# EAGLE design Board2 (EAGLE 7.4.0)
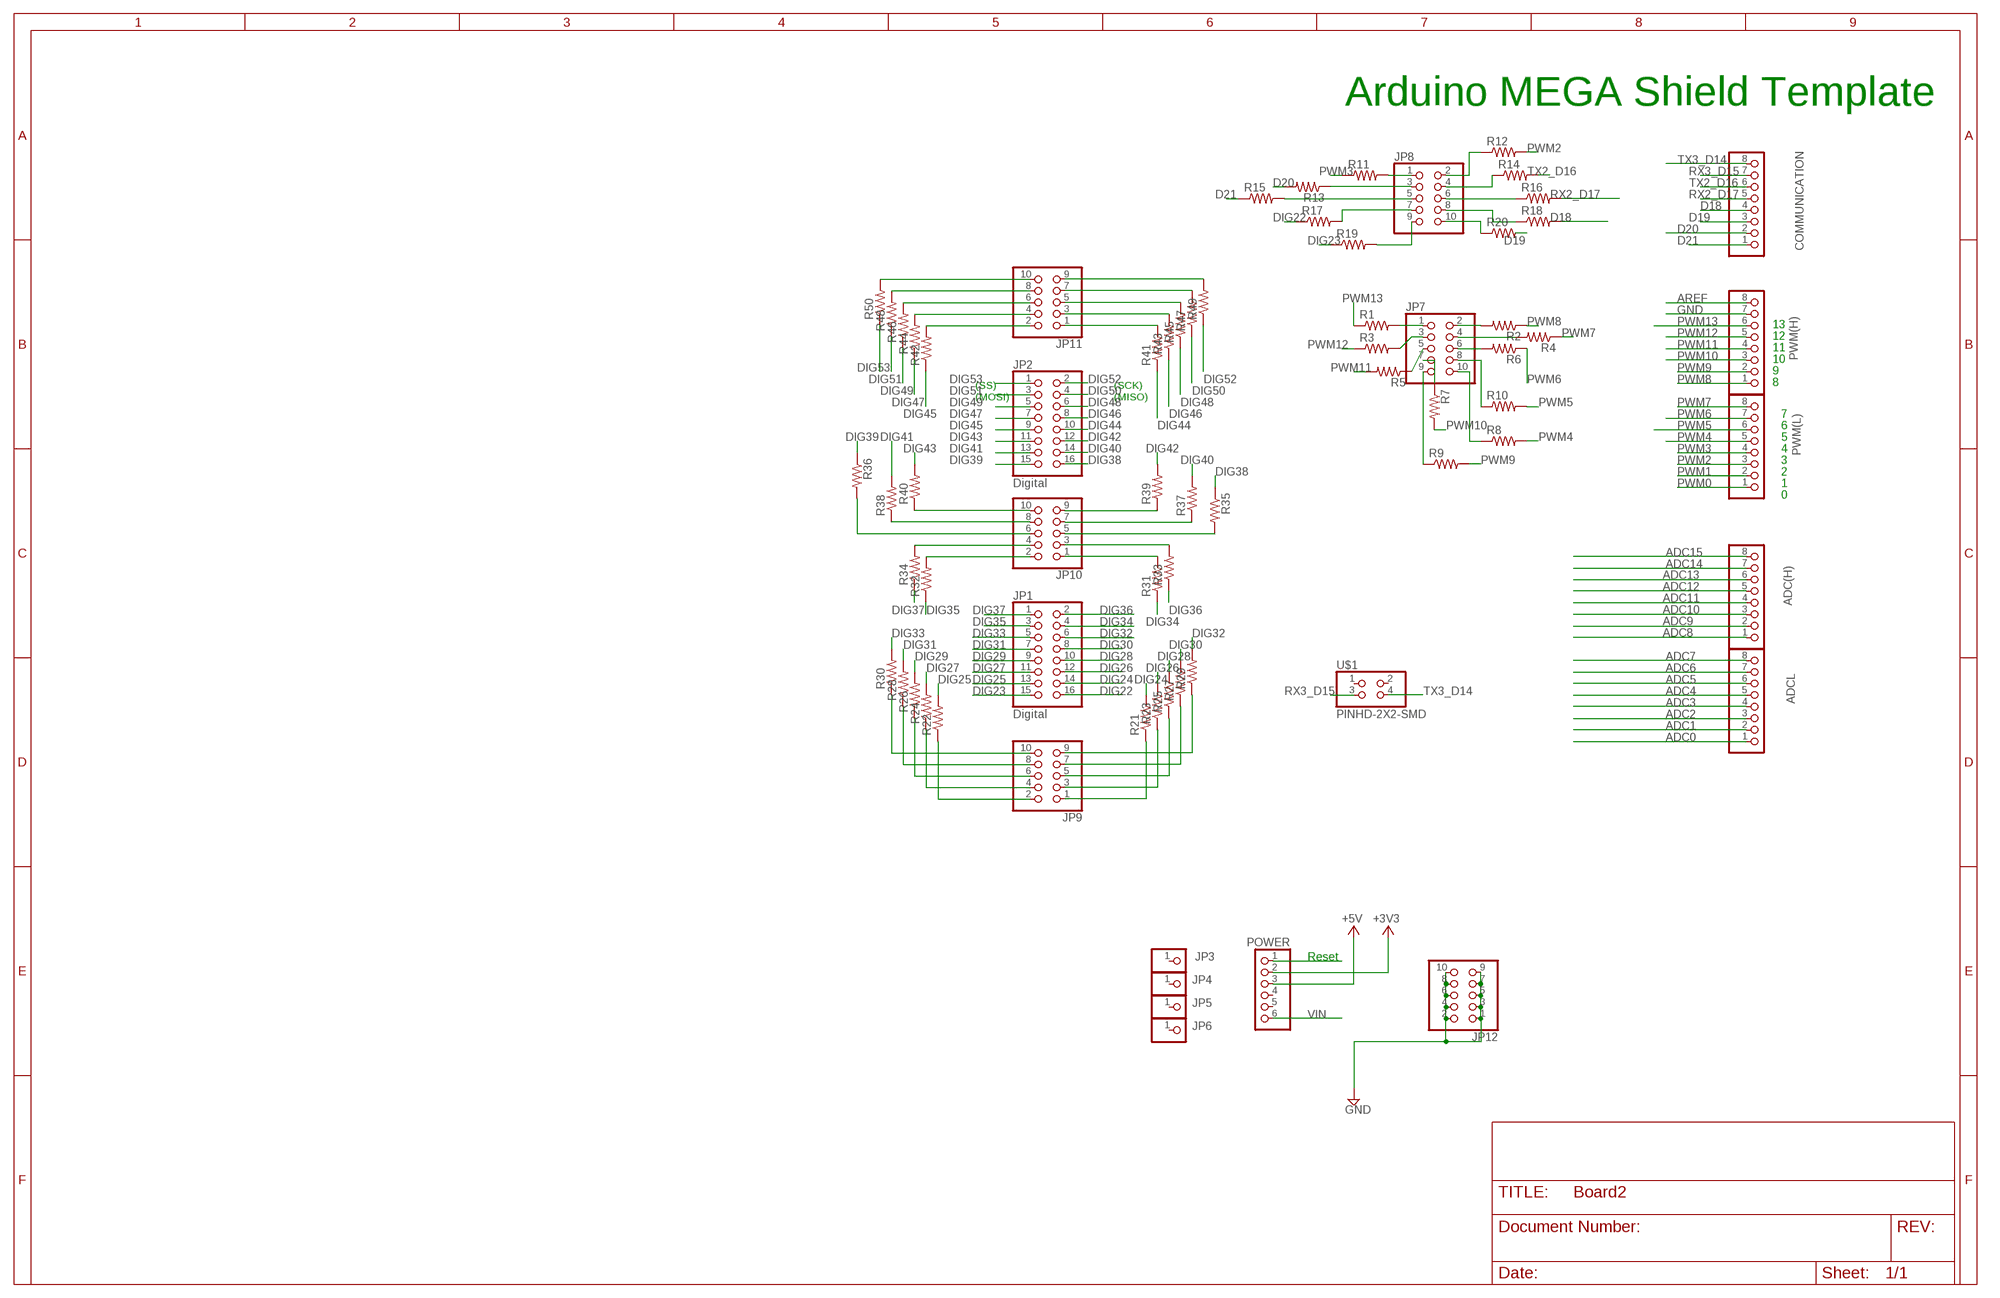
[diagram p0: schematic, sheet 1]

## Parts
ADC(H)  PINHD-1X8  [1X08]
ADCL  PINHD-1X8  [1X08]
COMMUNICATION  PINHD-1X8  [1X08]
JP1  Digital  PINHD-2X8  [2X08]
JP2  Digital  PINHD-2X8  [2X08]
JP3  PINHD-1X1  [1X01]
JP4  PINHD-1X1  [1X01]
JP5  PINHD-1X1  [1X01]
JP6  PINHD-1X1  [1X01]
JP7  PINHD-2X5SMT  [2X05_SMT]
JP8  PINHD-2X5SMT  [2X05_SMT]
JP9  PINHD-2X5SMT  [2X05_SMT]
JP10  PINHD-2X5SMT  [2X05_SMT]
JP11  PINHD-2X5SMT  [2X05_SMT]
JP12  PINHD-2X5SMT  [2X05_SMT]
POWER  PINHD-1X6  [1X06]
PWM(H)  PINHD-1X8  [1X08]
PWM(L)  PINHD-1X8  [1X08]
R1  R-US_M1206  [M1206]
R2  R-US_M1206  [M1206]
R3  R-US_M1206  [M1206]
R4  R-US_M1206  [M1206]
R5  R-US_M1206  [M1206]
R6  R-US_M1206  [M1206]
R7  R-US_M1206  [M1206]
R8  R-US_M1206  [M1206]
R9  R-US_M1206  [M1206]
R10  R-US_M1206  [M1206]
R11  R-US_M1206  [M1206]
R12  R-US_M1206  [M1206]
R13  R-US_M1206  [M1206]
R14  R-US_M1206  [M1206]
R15  R-US_M1206  [M1206]
R16  R-US_M1206  [M1206]
R17  R-US_M1206  [M1206]
R18  R-US_M1206  [M1206]
R19  R-US_M1206  [M1206]
R20  R-US_M1206  [M1206]
R21  R-US_M1206  [M1206]
R22  R-US_M1206  [M1206]
R23  R-US_M1206  [M1206]
R24  R-US_M1206  [M1206]
R25  R-US_M1206  [M1206]
R26  R-US_M1206  [M1206]
R27  R-US_M1206  [M1206]
R28  R-US_M1206  [M1206]
R29  R-US_M1206  [M1206]
R30  R-US_M1206  [M1206]
R31  R-US_M1206  [M1206]
R32  R-US_M1206  [M1206]
R33  R-US_M1206  [M1206]
R34  R-US_M1206  [M1206]
R35  R-US_M1206  [M1206]
R36  R-US_M1206  [M1206]
R37  R-US_M1206  [M1206]
R38  R-US_M1206  [M1206]
R39  R-US_M1206  [M1206]
R40  R-US_M1206  [M1206]
R41  R-US_M1206  [M1206]
R42  R-US_M1206  [M1206]
R43  R-US_M1206  [M1206]
R44  R-US_M1206  [M1206]
R45  R-US_M1206  [M1206]
R46  R-US_M1206  [M1206]
R47  R-US_M1206  [M1206]
R48  R-US_M1206  [M1206]
R49  R-US_M1206  [M1206]
R50  R-US_M1206  [M1206]
U$1  PINHD-2X2-SMD  [2X02SMD]

## Nets
+3V3 [power]: POWER.2
+5V [usbvcc]: POWER.3
ADC0: ADCL.1
ADC1: ADCL.2
ADC2: ADCL.3
ADC3: ADCL.4
ADC4: ADCL.5
ADC5: ADCL.6
ADC6: ADCL.7
ADC7: ADCL.8
ADC8: ADC(H).1
ADC9: ADC(H).2
ADC10: ADC(H).3
ADC11: ADC(H).4
ADC12: ADC(H).5
ADC13: ADC(H).6
ADC14: ADC(H).7
ADC15: ADC(H).8
AREF: PWM(H).8
D18: COMMUNICATION.4 R18.2
D19: COMMUNICATION.3 R20.2
D20: COMMUNICATION.2 R13.2
D21: COMMUNICATION.1 R15.1
DIG22: JP1.16 R17.1
DIG23: JP1.15 R19.1
DIG24: JP1.14 R21.2
DIG25: JP1.13 R22.2
DIG26 [gnd]: JP1.12 R23.2
DIG27: JP1.11 R24.2
DIG28: JP1.10 R25.2
DIG29: JP1.9 R26.2
DIG30: JP1.8 R27.2
DIG31: JP1.7 R28.2
DIG32: JP1.6 R29.2
DIG33: JP1.5 R30.2
DIG34: JP1.4 R31.1
DIG35: JP1.3 R32.1
DIG36: JP1.2 R33.1
DIG37: JP1.1 R34.1
DIG38: JP2.16 R35.1
DIG39: JP2.15 R36.1
DIG40: JP2.14 R37.2
DIG41: JP2.13 R38.2
DIG42: JP2.12 R39.2
DIG43: JP2.11 R40.2
DIG44: JP2.10 R41.1
DIG45: JP2.9 R42.1
DIG46: JP2.8 R43.1
DIG47: JP2.7 R44.1
DIG48: JP2.6 R45.1
DIG49: JP2.5 R46.1
DIG50: JP2.4 R47.1
DIG51: JP2.3 R48.1
DIG52: JP2.2 R49.1
DIG53: JP2.1 R50.1
GND [gnd]: JP12.1 JP12.2 JP12.3 JP12.4 JP12.5 JP12.6 JP12.7 JP12.8 JP12.9 JP12.10 PWM(H).7
N$1: JP7.3 R3.2
N$2: JP7.5 R5.1
N$3: JP7.7 R7.1
N$4: JP7.9 R9.1
N$5: JP7.4 R4.2
N$6: JP8.5 R15.2
N$7: JP7.6 R6.2
N$8: JP7.2 R2.2
N$9: JP7.8 R10.1
N$10: JP8.1 R11.2
N$11: JP8.2 R12.1
N$12: JP7.10 R8.1
N$13: JP8.7 R17.2
N$14: JP10.6 R36.2
N$15: JP8.6 R16.1
N$16: JP10.5 R35.2
N$17: JP8.4 R14.1
N$18: JP9.2 R22.1
N$19: JP7.1 R1.2
N$20: JP8.10 R20.1
N$21: JP9.4 R24.1
N$22: JP9.6 R26.1
N$23: JP9.8 R28.1
N$24: JP9.10 R30.1
N$25: JP9.1 R21.1
N$26: JP9.3 R23.1
N$27: JP9.5 R25.1
N$28: JP9.7 R27.1
N$29: JP9.9 R29.1
N$32: JP10.3 R33.2
N$33: JP10.1 R31.2
N$34: JP10.2 R32.2
N$35: JP10.4 R34.2
N$37: JP10.7 R37.1
N$38: JP10.9 R39.1
N$39: JP10.8 R38.1
N$40: JP10.10 R40.1
N$41: JP11.9 R49.2
N$42: JP11.7 R47.2
N$43: JP11.5 R45.2
N$44: JP11.3 R43.2
N$45: JP11.1 R41.2
N$46: JP11.2 R42.2
N$47: JP11.4 R44.2
N$48: JP11.6 R46.2
N$49: JP11.8 R48.2
N$50: JP11.10 R50.2
N$52: JP8.9 R19.2
PWM0: PWM(L).1
PWM1: PWM(L).2
PWM2: PWM(L).3 R12.2
PWM3: PWM(L).4 R11.1
PWM4: PWM(L).5 R8.2
PWM5: PWM(L).6 R10.2
PWM6: PWM(L).7 R6.1
PWM7: PWM(L).8 R4.1
PWM8: PWM(H).1 R2.1
PWM9: PWM(H).2 R9.2
PWM10: PWM(H).3 R7.2
PWM11: PWM(H).4 R5.2
PWM12: PWM(H).5 R3.1
PWM13: PWM(H).6 R1.1
RESET: POWER.1
RX1_D19: JP8.8 R18.1
RX2_D17: COMMUNICATION.5 R16.2
RX3_D15: COMMUNICATION.7 U$1.3
RX4_D14: JP8.3 R13.1
TX2_D16: COMMUNICATION.6 R14.2
TX3_D14: COMMUNICATION.8 U$1.4
VIN [power]: POWER.6
Unconnected: JP3.1 JP4.1 JP5.1 JP6.1 POWER.4 POWER.5 U$1.1 U$1.2

## Notes on the sheet
- Arduino MEGA Shield Template
- 13
- 12
- 11
- 10
- 9
- (SS) | (SCK) | 8
- (MOSI) | (MISO)
- 7
- 6
- 5
- 4
- 3
- 2
- 1
- 0
- Reset

## Library data of the parts
ADC(H) ADCL COMMUNICATION PWM(H) PWM(L) = pinhead:PINHD-1X8: PIN HEADER
JP1 JP2 = pinhead:PINHD-2X8: PIN HEADER
JP3-JP6 = pinhead:PINHD-1X1: PIN HEADER
JP7-JP12 = pinhead+:PINHD-2X5: PIN HEADER
POWER = pinhead:PINHD-1X6: PIN HEADER
R1-R50 = resistor:R-US_: RESISTOR, American symbol
U$1 = fab:PINHD-2X2-SMD

## Net classes
0 default: width 0.203 mm, drill 0.406 mm, clearance 0.203 mm
1 power: width 0.203 mm, drill 0.711 mm, clearance 0.203 mm
2 gnd: width 0.203 mm, drill 0.711 mm, clearance 0.203 mm
3 usbvcc: width 0.203 mm, drill 0.711 mm, clearance 0.203 mm

## Board
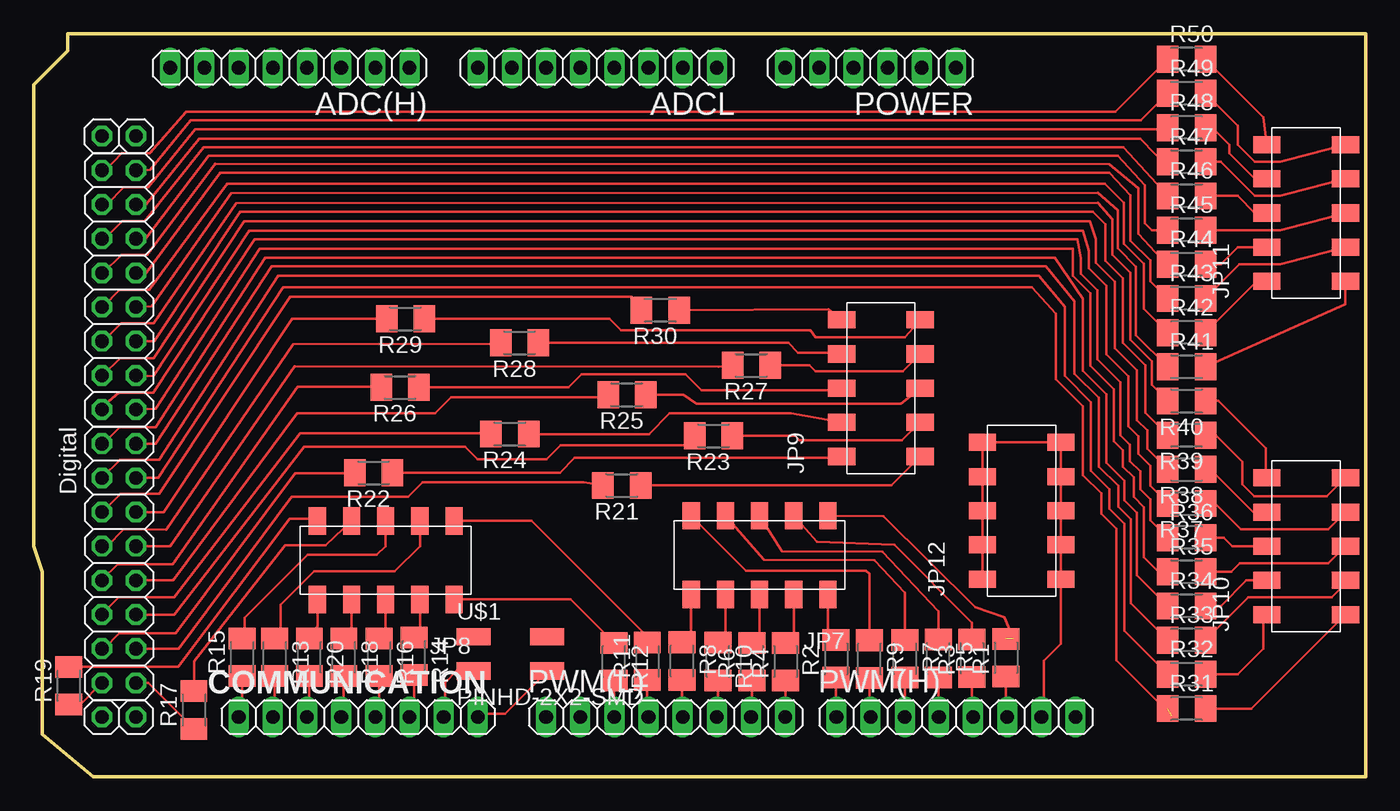
[diagram p1: board, top side]

Size 99.06 x 55.25 mm. Coordinates in mm from the lower left corner, seen from the top.
Outline: 99.06,0 4.45,0 0.64,3.17 0.64,15.24 0,17.14 0,51.44 2.54,53.98 2.54,55.25 99.06,55.25 99.06,0
Copper layers (1*16): Top 0.035mm / dielectric 1.5mm / Bottom 0.035mm
Design rules "fab": minimum track width 0.3mm, minimum drill 32mil, track to track 0.397mm, track to pad 0.397mm, pad to pad 0.397mm, via to via 0.397mm, smd to smd 0.315mm, copper to edge 40mil, drill to drill 16mil, minimum pad ring 10mil, minimum via ring 8mil, stop-mask expansion 4mil, vias tented up to drill 0mil, thermal gap 10mil

### Footprints (pad centres in the part's own frame; a part is rotated, then mirrored left to right if it is on the bottom)
1X08 = drill 1.016 long: 1 -8.89,0; 2 -6.35,0; 3 -3.81,0; 4 -1.27,0; 5 1.27,0; 6 3.81,0; 7 6.35,0; 8 8.89,0
2X08 = drill 1.016 octagon: 1 -8.89,-1.27; 2 -8.89,1.27; 3 -6.35,-1.27; 4 -6.35,1.27; 5 -3.81,-1.27; 6 -3.81,1.27; 7 -1.27,-1.27; 8 -1.27,1.27; 9 1.27,-1.27; 10 1.27,1.27; 11 3.81,-1.27; 12 3.81,1.27; 13 6.35,-1.27; 14 6.35,1.27; 15 8.89,-1.27; 16 8.89,1.27
1X01 = drill 1.016 octagon: 1 0,0
2X05_SMT = smd 1.27 x 2.032: 1 -5.08,-2.921; 2 -5.08,2.921; 3 -2.54,-2.921; 4 -2.54,2.921; 5 0,-2.921; 6 0,2.921; 7 2.54,-2.921; 8 2.54,2.921; 9 5.08,-2.921; 10 5.08,2.921
1X06 = drill 1.016 long: 1 -6.35,0; 2 -3.81,0; 3 -1.27,0; 4 1.27,0; 5 3.81,0; 6 6.35,0
M1206 = smd 1.6 x 2: 1 -1.4,0; 2 1.4,0
2X02SMD = smd 2.54 x 1.27: 1 -2.54,1.27; 2 2.92,1.27; 3 -2.54,-1.27; 4 2.92,-1.27

### Placement (x,y rotation side)
ADC(H)  19.05,52.7 180 top
ADCL  41.91,52.7 180 top
COMMUNICATION  24.13,4.45 0 top
JP1  6.35,15.88 270 top
JP2  6.35,36.2 270 top
JP3  7.62,4.45 180 top
JP4  5.08,4.45 180 top
JP5  7.62,47.62 180 top
JP6  5.08,47.62 180 top
JP7  53.98,16.48 180 top
JP8  26.18,16.11 180 top
JP9  63,28.89 90 top
JP10  94.61,17.14 90 top
JP11  94.61,41.91 90 top
JP12  73.46,19.78 90 top
POWER  62.23,52.7 180 top
PWM(H)  68.58,4.45 0 top
PWM(L)  46.99,4.45 0 top
R1  72.31,8.86 90 top
R2  59.66,8.77 90 top
R3  69.77,8.82 90 top
R4  55.92,8.57 90 top
R5  67.27,8.8 270 top
R6  53.4,8.57 90 top
R7  64.79,8.78 270 top
R8  48.21,8.61 270 top
R9  62.14,8.76 270 top
R10  50.88,8.57 270 top
R11  45.63,8.59 90 top
R12  43.15,8.57 270 top
R13  17.92,8.89 270 top
R14  28.28,8.97 270 top
R15  15.5,8.9 90 top
R16  25.7,8.89 270 top
R17  11.92,4.98 90 top
R18  23.07,8.89 270 top
R19  2.61,6.77 90 top
R20  20.5,8.89 270 top
R21  43.74,21.66 180 top
R22  25.27,22.6 180 top
R23  50.55,25.35 180 top
R24  35.41,25.49 180 top
R25  44.11,28.41 180 top
R26  27.24,28.95 180 top
R27  53.37,30.59 180 top
R28  36.14,32.26 180 top
R29  27.65,34.05 180 top
R30  46.59,34.7 180 top
R31  85.72,5.08 0 top
R32  85.72,7.62 0 top
R33  85.72,10.16 0 top
R34  85.72,12.7 0 top
R35  85.72,15.24 0 top
R36  85.72,17.78 0 top
R37  85.72,20.32 180 top
R38  85.72,22.86 180 top
R39  85.72,25.4 180 top
R40  85.72,27.94 180 top
R41  85.72,30.48 0 top
R42  85.72,33.02 0 top
R43  85.72,35.56 0 top
R44  85.72,38.1 0 top
R45  85.72,40.64 0 top
R46  85.72,43.18 0 top
R47  85.72,45.72 0 top
R48  85.72,48.26 0 top
R49  85.72,50.8 0 top
R50  85.72,53.34 0 top
U$1  35.26,9.14 0 top

### Tracks (layer width: path | path; a pad name or v marks a point on that pad's centre or on a via)
D18
  Top 0.203: R18.2 23.07,4.65 COMMUNICATION.4
D19
  Top 0.203: R20.2 20.5,4.63 COMMUNICATION.3
D20
  Top 0.203: R13.2 17.92,4.59 COMMUNICATION.2
D21
  Top 0.203: R15.1 15.5,4.7 COMMUNICATION.1
DIG22
  Top 0.203: JP1.16 8.51,6.99 R17.1
DIG23
  Top 0.203: R19.1 3.47,5.38 JP1.15
DIG24
  Top 0.203: JP1.14 10.77,9.53 19.2,20.81 27.83,20.81 28.92,21.91 40.88,21.91 R21.2
DIG25
  Top 0.203: JP1.13 5.25,9.53 6.38,10.66 10.56,10.66 19.44,22.58 23.85,22.58 R22.2
DIG26
  Top 0.203: JP1.12 10.45,12.06 20.11,24.52 32.08,24.52 32.99,23.61 38.16,23.61 39.19,24.64 48.97,24.64 49.7,25.37 49.17,25.37 R23.2
DIG27
  Top 0.203: JP1.11 5.08,12.1 6.32,13.33 10.44,13.33 19.81,25.56 33.94,25.56 R24.2
DIG28
  Top 0.203: JP1.10 10.36,14.6 19.6,27.01 29.85,27.01 31.04,28.2 42.51,28.2 R25.2
DIG29
  Top 0.203: JP1.9 5.08,14.66 6.24,15.82 10.33,15.8 19.62,29.01 25.09,29.01 25.28,29.2 25.59,29.2 R26.2
DIG30
  Top 0.203: JP1.8 10.14,17.13 19.43,30.54 50.91,30.49 R27.2
DIG31
  Top 0.203: JP1.7 5.47,17.14 6.71,18.39 9.87,18.38 19.28,32.16 34.4,32.21 R28.2
DIG32
  Top 0.203: R29.2 19.21,34.05 9.66,19.67 7.64,19.67 JP1.6
DIG33
  Top 0.203: JP1.5 5.11,19.69 6.47,21.05 9.35,21.05 19.06,35.69 44.47,35.69 R30.2
DIG34  (1 unrouted)
  Top 0.203: JP1.4 9.26,22.23 18.54,36.38 74.22,36.38 76,34.42 76,29.56 78.02,27.54 78.02,22.43 79.39,21.07 79.39,19.56 80.5,18.44 80.5,8.69 84.63,4.56
DIG35
  Top 0.203: JP1.3 6.43,23.58 9.32,23.58 18.18,37.25 74.73,37.25 76.66,34.95 76.66,29.81 78.62,27.85 78.62,22.74 79.98,21.38 79.98,19.95 81.1,18.83 81.1,10.85 R32.1
DIG36
  Top 0.203: JP1.2 9.1,24.77 17.68,37.96 75.28,37.96 77.39,35.37 77.39,29.98 79.21,28.16 79.21,23.06 80.64,21.63 80.64,20.09 81.59,19.14 81.59,12.9 R33.1
DIG37
  Top 0.203: JP1.1 5.16,24.77 6.39,26 9.08,26 17.23,38.57 75.94,38.57 78.02,35.54 78.02,30.19 79.77,28.44 79.77,23.34 81.1,22.01 81.1,20.58 82.04,19.63 82.04,14.98 R34.1
DIG38
  Top 0.203: JP2.16 9.07,27.36 16.81,39.24 77.27,39.24 77.29,37.75 77.29,37.26 78.58,35.96 78.58,30.58 80.33,28.83 80.33,24.95 80.99,24.28 80.99,23.06 81.8,22.26 81.8,20.82 82.57,20.05 82.57,16.31 83.64,15.24 R35.1
DIG39
  Top 0.203: JP2.15 5.08,27.49 6.34,28.57 8.9,28.56 16.44,39.97 77.3,39.94 77.61,39.94 77.88,38.55 77.88,37.39 79.11,36.17 79.11,31.03 80.82,29.32 80.82,25.4 81.52,24.7 81.52,23.48 82.29,22.71 82.29,21.38 83.02,20.65 83.02,19.08 R36.1 84.46,17.64 84.46,17.21
DIG40
  Top 0.203: JP2.14 8.88,29.79 16.02,40.59 78,40.59 78.48,39.11 78.48,37.81 79.77,36.52 79.77,31.42 81.41,29.77 81.41,26.07 82.15,25.33 82.15,24 83.02,23.13 83.02,21.62 R37.2
DIG41
  Top 0.203: JP2.13 5.16,29.85 6.42,31.11 8.92,31.11 15.64,41.32 78.54,41.32 78.97,39.95 78.97,38.23 80.4,36.8 80.4,31.87 82.04,30.23 82.04,26.52 82.81,25.75 82.81,24.37 R38.2
DIG42
  Top 0.203: JP2.12 8.98,32.38 15.35,42.02 78.76,41.99 79.68,41.08 79.68,38.36 80.98,37.06 80.98,32.27 82.66,30.59 82.66,27.06 R39.2
DIG43
  Top 0.203: JP2.11 5.17,32.38 6.5,33.72 8.92,33.72 15.06,42.65 79.14,42.68 80.22,41.43 80.22,38.8 81.55,37.48 81.55,32.48 83.14,30.89 83.14,29.13 R40.2
DIG44
  Top 0.203: JP2.10 8.77,34.99 14.7,43.39 79.15,43.41 80.61,42.11 80.61,39.29 81.97,37.93 81.97,32.84 R41.1
DIG45
  Top 0.203: JP2.9 5.12,34.93 6.41,36.21 8.61,36.21 14.38,44.09 79.64,44.09 81.06,42.66 81.06,39.61 82.55,38.12 82.55,34.79 R42.1
DIG46
  Top 0.203: JP2.8 8.3,37.36 13.85,44.91 79.97,44.91 81.55,43.25 81.55,39.87 83.04,38.38 83.04,36.85 R43.1
DIG47
  Top 0.203: JP2.7 5.18,37.47 6.54,38.83 8.45,38.83 13.5,45.58 79.99,45.54 82.14,43.74 82.16,40.37 84.22,38.1 R44.1
DIG48
  Top 0.203: JP2.6 8.29,39.95 13.01,46.16 80.62,46.18 82.64,43.97 82.64,41.15 83.15,40.64 R45.1
DIG49
  Top 0.203: JP2.5 5.29,40.01 6.6,41.31 8.28,41.31 12.63,46.81 81.04,46.81 R46.1
DIG50
  Top 0.203: JP2.4 8.35,42.55 12.32,47.42 82.28,47.42 84.5,45.16 84.5,45.55 R47.1
DIG51
  Top 0.203: JP2.3 5.46,42.55 6.71,43.83 8.53,43.83 12,48.12 84.19,48.12 R48.1
DIG52
  Top 0.203: JP2.2 8.67,45.12 11.68,48.81 82.33,48.81 R49.1
DIG53
  Top 0.203: JP2.1 5.36,45.09 6.57,46.34 8.63,46.34 11.33,49.45 25.83,49.45 80.44,49.45 R50.1
GND
  Top 0.203: JP12.2 JP12.4 JP12.6 JP12.8 JP12.10 JP12.9 JP12.7 JP12.5 JP12.3 JP12.1 76.38,9.88 75.12,8.62 75.12,4.64 PWM(H).7
N$1
  Top 0.203: R3.2 69.77,11.44 64.02,17.26 58.24,17.46 JP7.3
N$2
  Top 0.203: R5.1 67.27,12.3 63.13,16.74 55.65,16.78 JP7.5
N$3
  Top 0.203: R7.1 64.78,13.69 62.53,16.12 54.29,16.14 JP7.7
N$4
  Top 0.203: R9.1 62.14,15.11 61.91,15.34 52.96,15.34 JP7.9
N$5
  Top 0.203: JP7.4 56.52,10.62 R4.2
N$6
  Top 0.203: JP8.5 26.18,17.16 25.52,16.5 20.36,16.5 15.68,11.81 15.68,9.99 15.49,9.81 15.49,10.06 R15.2
N$7
  Top 0.203: JP7.6 53.98,10.57 R6.2
N$8
  Top 0.203: JP7.2 59.06,10.91 R2.2
N$9
  Top 0.203: JP7.8 51.44,10.37 R10.1
N$10
  Top 0.203: JP8.1 37.02,19.03 46.3,9.75 46.12,9.75 45.94,9.57 45.94,9.68 R11.2
N$11
  Top 0.203: JP8.2 39.93,13.19 R12.1
N$12
  Top 0.203: JP7.10 48.9,10.69 R8.1
N$13
  Top 0.203: R17.2 11.92,8.61 18.71,17.23 21.72,17.23 JP8.7
N$14
  Top 0.203: R36.2 88.49,17.78 89.12,17.14 JP10.6
N$15
  Top 0.203: JP8.6 26.18,11.07 R16.1
N$16
  Top 0.203: R35.2 89.07,15.24 89.7,15.87 96.27,15.87 JP10.5
N$17
  Top 0.203: JP8.4 28.72,11.05 R14.1
N$18
  Top 0.203: R22.1 39.16,22.6 40.22,23.73 60,23.73 JP9.2
N$19  (1 unrouted)
  Top 0.203: JP7.1 63.17,19.39 70.01,12.63 72.17,11.85 72.84,10.29
N$20
  Top 0.203: JP8.10 21.1,11.19 R20.1
N$21
  Top 0.203: R24.1 45.74,25.48 47.27,27.02 56.32,27.02 JP9.4
N$22
  Top 0.203: R26.1 39.78,28.95 40.76,29.92 48.47,29.92 49.66,28.73 59.92,28.73 JP9.6
N$23
  Top 0.203: R28.1 56.13,32.26 56.85,31.54 59.98,31.54 JP9.8
N$24
  Top 0.203: R30.1 59.1,34.74 JP9.10
N$25
  Top 0.203: R21.1 63.77,21.66 JP9.1
N$26
  Top 0.203: R23.1 56.59,25.35 56.93,25.01 64.58,25.01 JP9.3
N$27
  Top 0.203: R25.1 48.32,28.41 49.28,27.73 64.47,27.73 JP9.5
N$28
  Top 0.203: R27.1 57.7,30.59 58.14,30.16 64.65,30.16 JP9.7
N$29
  Top 0.203: R29.1 42.82,34.05 43.66,33.21 57.76,33.21 58.14,32.68 64.78,32.68 JP9.9
N$32
  Top 0.203: R33.2 90.3,13.33 96.52,13.33 97.54,14.35 JP10.3
N$33
  Top 0.203: R31.2 90.55,5.08 JP10.1
N$34
  Top 0.203: R32.2 89.53,7.62 91.44,9.53 91.44,11.81 JP10.2
N$35
  Top 0.203: R34.2 88.27,12.7 90.17,14.6 JP10.4
N$37
  Top 0.203: R37.1 87.85,20.32 89.76,18.41 96.27,18.41 JP10.7
N$38
  Top 0.203: R39.1 87.9,25.4 89.86,23.44 89.86,21.75 90.76,20.85 96.16,20.85 JP10.9
N$39
  Top 0.203: R38.1 87.48,22.86 90.97,19.37 91.38,19.37 JP10.8
N$40
  Top 0.203: R40.1 88.09,27.94 91.61,24.42 91.61,22.3 JP10.10
N$41
  Top 0.203: JP11.9 92.71,45.72 90.81,45.72 89.53,46.99 89.53,48.39 R49.2
N$42
  Top 0.203: R47.2 88.27,45.72 90.81,43.18 92.71,43.18 JP11.7
N$43
  Top 0.203: JP11.5 92.71,40.64 R45.2
N$44
  Top 0.203: JP11.3 92.71,38.1 89.67,38.1 R43.2
N$45
  Top 0.203: JP11.1 97.54,35.14 R41.2
N$46
  Top 0.203: JP11.2 90.94,36.83 R42.2
N$47
  Top 0.203: R44.2 88.27,38.1 89.53,39.37 JP11.4
N$48
  Top 0.203: R46.2 89.53,43.18 90.81,41.91 JP11.6
N$49
  Top 0.203: R48.2 87.63,48.26 88.9,46.99 88.9,46.36 90.81,44.45 JP11.8
N$50
  Top 0.203: JP11.10 91.44,49.02 R50.2
N$52
  Top 0.203: R19.2 10.76,8.17 19.02,19.17 20.45,19.17 JP8.9
PWM2
  Top 0.203: R12.2 43.15,4.48 PWM(L).3
PWM3
  Top 0.203: R11.1 45.63,5.25 46.18,4.7 45.98,4.7 PWM(L).4
PWM4
  Top 0.203: R8.2 48.21,5.43 48.32,5.32 48.32,4.5 PWM(L).5
PWM5
  Top 0.203: R10.2 50.88,4.52 PWM(L).6
PWM6
  Top 0.203: R6.1 53.4,4.51 PWM(L).7
PWM7
  Top 0.203: R4.1 55.92,4.48 PWM(L).8
PWM8
  Top 0.203: R2.1 59.66,4.47 PWM(H).1
PWM9
  Top 0.203: R9.2 62.14,4.54 PWM(H).2
PWM10
  Top 0.203: R7.2 64.78,4.46 PWM(H).3
PWM11
  Top 0.203: R5.2 67.27,4.49 PWM(H).4
PWM12
  Top 0.203: R3.1 69.77,4.53 PWM(H).5
PWM13
  Top 0.203: R1.1 72.31,4.53 PWM(H).6
RX1_D19
  Top 0.203: JP8.8 23.64,11.17 R18.1
RX2_D17
  Top 0.203: R16.2 25.7,4.75 COMMUNICATION.5
RX3_D15
  Top 0.203: U$1.3 31.45,7.87 30.59,7.01 30.59,4.55 COMMUNICATION.7
RX4_D14
  Top 0.203: JP8.3 28.72,17.14 26.86,15.28 20.84,15.28 18.35,12.79 18.35,10.66 18.17,10.48 17.87,10.48 R13.1
TX2_D16
  Top 0.203: 28.04,4.54 COMMUNICATION.6 28.28,4.79 R14.2
TX3_D14
  Top 0.203: U$1.4 38.18,7.8 35.06,4.68 33.25,4.68 COMMUNICATION.8